# EAGLE schematic 48_buck (EAGLE 7.3.0)
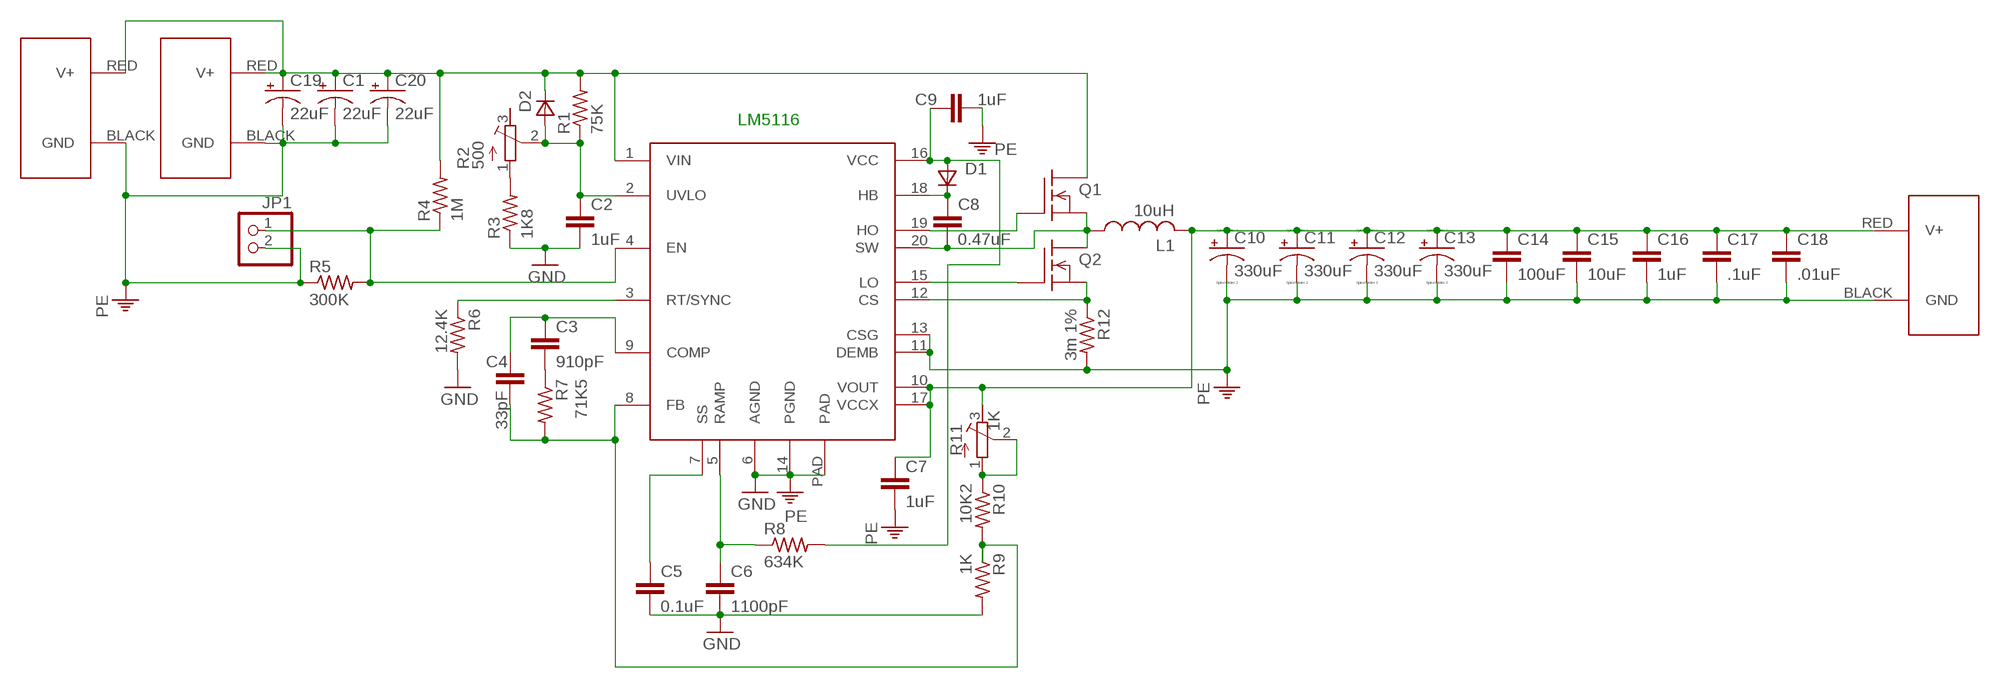
[diagram p0: schematic, sheet 1]

## Parts
C1  22uF  CPOL-USE3.5-8  [E3,5-8]
C2  1uF  C-EUC1206  [C1206]
C3  910pF  C-EUC0805  [C0805]
C4  33pF  C-EUC0805  [C0805]
C5  0.1uF  C-EUC0805  [C0805]
C6  1100pF  C-EUC0805  [C0805]
C7  1uF  C-EUC0805  [C0805]
C8  0.47uF  C-EUC0805  [C0805]
C9  1uF  C-EUC1206  [C1206]
C10  330uF  CPOL-USE5-10.5  [E5-10,5]
C11  330uF  CPOL-USE5-10.5  [E5-10,5]
C12  330uF  CPOL-USE5-10.5  [E5-10,5]
C13  330uF  CPOL-USE5-10.5  [E5-10,5]
C14  100uF  C-EUC1210  [C1210]
C15  10uF  C-EUC1206  [C1206]
C16  1uF  C-EUC1206  [C1206]
C17  .1uF  C-EUC0805  [C0805]
C18  .01uF  C-EUC0805  [C0805]
C19  22uF  CPOL-USE3.5-8  [E3,5-8]
C20  22uF  CPOL-USE3.5-8  [E3,5-8]
D1  VAR2SOT23  [SOT-23]
D2  VAR2SOT23  [SOT-23]
J1  POWERPOLE_POWER45A_HORIZONTAL_DRILL  [POWERPOLE_PAIR_45A_HORIZ_HOLE]
J2  POWERPOLE_POWER45A_HORIZONTAL_DRILL  [POWERPOLE_PAIR_45A_HORIZ_HOLE]
J3  POWERPOLE_POWER10AWG  [POWERPOLE_PAIR_10AWG]
JP1  PINHD-1X2  [1X02]
L1  10uH  AIRD-03  [AIRD-03]
LM5116  LM5116  [TSSOP20]
Q1  BUZ21  [TO220]
Q2  BUZ21  [TO220]
R1  75K  R-US_R1206  [R1206]
R2  500  3303X-3  [3303X-3]
R3  1K8  R-US_R1206  [R1206]
R4  1M  R-US_R0805  [R0805]
R5  300K  R-US_R0805  [R0805]
R6  12.4K  R-US_R0805  [R0805]
R7  71K5  R-US_R0805  [R0805]
R8  634K  R-US_R0805  [R0805]
R9  1K  R-US_R0805  [R0805]
R10  10K2  R2818  [R2818]
R11  1K  3303X-3  [3303X-3]
R12  3m 1%  R-US_R0805  [R0805]

## Nets
GND: C2.2 C5.2 C6.2 LM5116.6(AGND) LM5116.14(PGND) LM5116.PAD R3.1 R6.2 R9.2 ; supply symbol labelled PE
N$1: R2.1(A) R3.2
N$2: JP1.1 LM5116.4(EN) R4.1 R5.2
N$3: C5.1 LM5116.7(SS)
N$4: C9.1 D1.3(A) LM5116.16(VCC) R8.2
N$5: C3.2 R7.1
N$6: LM5116.3(RT/SYNC) R6.1
N$7: C3.1 C4.1 LM5116.9(COMP)
N$8: LM5116.15(LO) Q2.1(G)
N$9: C6.1 LM5116.5(RAMP) R8.1
N$10: C8.1 D1.1(C) LM5116.18(HB)
N$11: C2.1 D2.3(A) LM5116.2(UVLO) R1.1 R2.2(S)
N$12: LM5116.19(HO) Q1.1(G)
N$14: C7.1 C10.+ C11.+ C12.+ C13.+ C14.1 C15.1 C16.1 C17.1 C18.1 J1.RED(V+) L1.P$2 LM5116.10(VOUT) LM5116.17(VCCX) R11.3(E)
N$15: LM5116.12(CS) Q2.3(S) R12.1
N$16: R10.P$1 R11.1(A) R11.2(S)
N$17: C1.+ C19.+ C20.+ D2.1(C) J2.RED(V+) J3.RED(V+) LM5116.1(VIN) Q1.2(D) R1.2 R4.2
N$19: C4.2 LM5116.8(FB) R7.2 R9.1 R10.P$2
N$20: C8.2 L1.P$1 LM5116.20(SW) Q1.3(S) Q2.2(D)
PE: C1.- C7.2 C9.2 C10.- C11.- C12.- C13.- C14.2 C15.2 C16.2 C17.2 C18.2 C19.- C20.- J1.BLACK(GND) J2.BLACK(GND) J3.BLACK(GND) JP1.2 LM5116.11(DEMB) LM5116.13(CSG) R5.1 R12.2
Unconnected: R2.3(E)

## Notes on the sheet
- LM5116

## Library data of the parts
C1 C19 C20 = rcl:CPOL-US: POLARIZED CAPACITOR, American symbol
C2-C9 C14-C18 = rcl:C-EU: CAPACITOR, European symbol
C10-C13 = resistor:CPOL-US: POLARIZED CAPACITOR, American symbol
D1 D2 = zetex:VAR2SOT23: DIODE; OC_FARNELL: unknown; OC_NEWARK: unknown
J1-J3 = powerpoles:POWERPOLE_POWER: Anderson Powerpole Power Connector using ameteur radio standard layout
JP1 = pinhead:PINHD-1X2: PIN HEADER
L1 = 48buck_library:AIRD-03
LM5116 = 48buck_library:LM5116
Q1 Q2 = transistor-fet:BUZ21: N-Channel Enhancement MOSFET 100V; 19A; 0,1Ohm
R1 R3-R9 R12 = rcl:R-US_: RESISTOR, American symbol
R2 R11 = 48buck_library:3303X-3
R10 = 48buck_library:R2818